# Altium schematic sheet [SCH]_MainProcessor.SchDoc: MOTHERBOARD
size 297 x 209 mm; CheckedBy: THIEN-KEMC; CompanyName: TEAM GA MO; DrawnBy: Vo Hao Hao; Organization: TEAM GA MO; Address1: TEAM GA MO Limited; Address2: 30, Nhat Hamet, Thanh Hoa, Phung Hiep, HG; TGM_Number: TGA-00005-02-1; Projet: EGG INCUBATION (PC-BASED MEASUREMENT AND CONTROL SYSTEMS); ModifiedBy: -; CreateDate: XX/XX/XXXX; CheckedDate: -; Title2: MAIN PROCESSOR ESP32; DivGrp: TGM; Designer: Vo Hao Hao
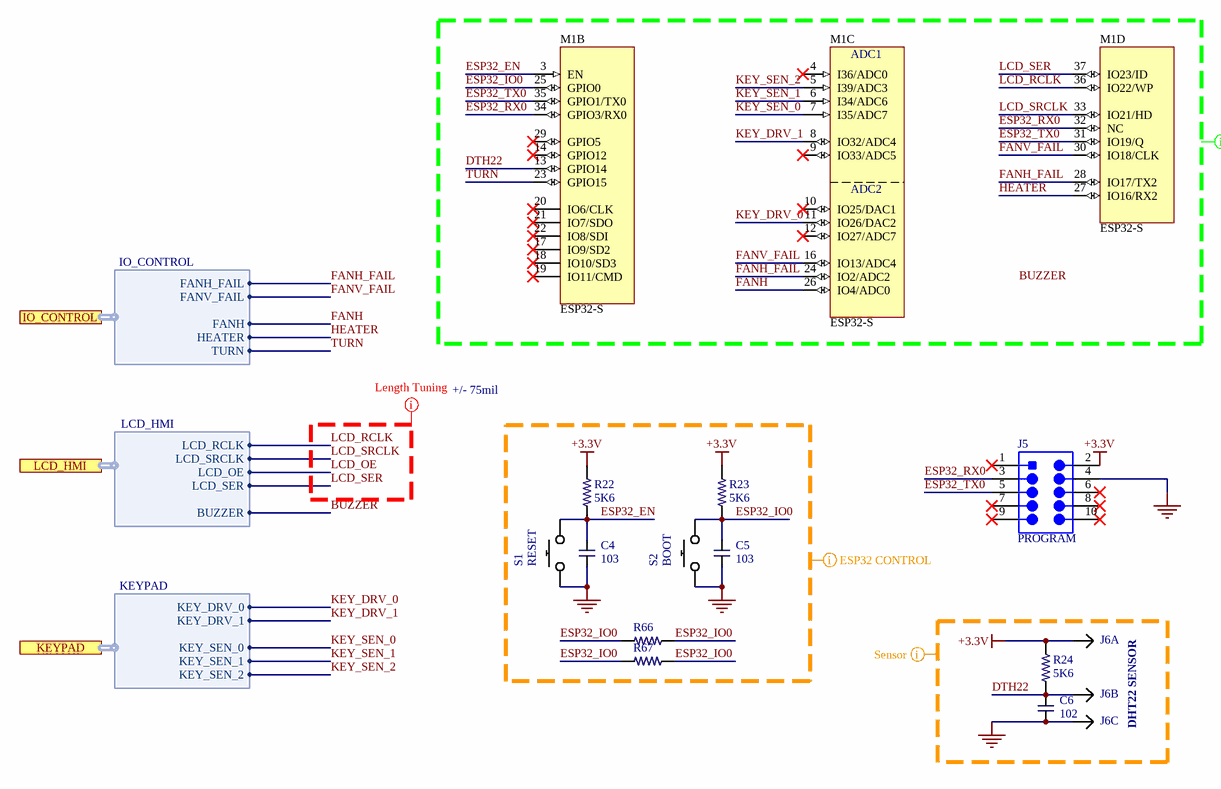
[diagram p0: [SCH]_MainProcessor.SchDoc]

## Parts
C4  103  [CAP-SMD-0805]
C5  103  [CAP-SMD-0805]
C6  102  [CAP-SMD-0805]
J5  PROGRAM  [IDC10]
J6  DHT22  [KF3/5.08]  (value not drawn)  (parts A,B,C of 3)
M1  ESP32-S  [ESP32-S-Footprint]  (parts B,C,D of 4)
R22  value 5K6  [RES-SMD-0805]  (hidden comment: R0805)
R23  value 5K6  [RES-SMD-0805]  (hidden comment: R0805)
R24  value 5K6  [RES-SMD-0805]  (hidden comment: R0805)
R66  R0805  [RES-SMD-0805]  (value not drawn)
R67  R0805  [RES-SMD-0805]  (value not drawn)
S1  RESET  [TL3342F260QG]
S2  BOOT  [TL3342F260QG]

## Ports
IO_CONTROL (harness IO_CONTROL), KEYPAD (harness KEYPAD), LCD_HMI (harness LCD_HMI)

## Harnesses
KEYPAD: KEY_SEN_0, KEY_SEN_1, KEY_SEN_2, KEY_DRV_0, KEY_DRV_1
IO_CONTROL: FANH_FAIL, FANV_FAIL, FANH, HEATER, TURN
LCD_HMI: LCD_RCLK, LCD_SRCLK, LCD_OE, LCD_SER, BUZZER

## Nets
+3.3V: J5.2 J6.1 R22.2 R23.2 R24.2
GND: C4.1 C5.1 C6.1 J5.4 J6.3 S1.1 S2.1
BUZZER: port LCD_HMI.BUZZER
DTH22: C6.2 J6.2 M1.13(GPIO14) R24.1
ESP32_EN: C4.2 M1.3(EN) R22.1 S1.2
ESP32_IO0: C5.2 M1.25(GPIO0) R23.1 R66.1 R66.2 R67.1 R67.2 S2.2
ESP32_RX0: J5.3 M1.32(NC) M1.34(GPIO3/RX0)
ESP32_TX0: J5.5 M1.31(IO19/Q) M1.35(GPIO1/TX0)
FANH: M1.26(IO4/ADC0) ; port IO_CONTROL.FANH
FANH_FAIL: M1.24(IO2/ADC2) M1.28(IO17/TX2) ; port IO_CONTROL.FANH_FAIL
FANV_FAIL: M1.16(IO13/ADC4) M1.30(IO18/CLK) ; port IO_CONTROL.FANV_FAIL
HEATER: M1.27(IO16/RX2) ; port IO_CONTROL.HEATER
KEY_DRV_0: M1.11(IO26/DAC2) ; port KEYPAD.KEY_DRV_0
KEY_DRV_1: M1.8(IO32/ADC4) ; port KEYPAD.KEY_DRV_1
KEY_SEN_0: M1.7(I35/ADC7) ; port KEYPAD.KEY_SEN_0
KEY_SEN_1: M1.6(I34/ADC6) ; port KEYPAD.KEY_SEN_1
KEY_SEN_2: M1.5(I39/ADC3) ; port KEYPAD.KEY_SEN_2
LCD_OE: port LCD_HMI.LCD_OE
LCD_RCLK: M1.36(IO22/WP) ; port LCD_HMI.LCD_RCLK
LCD_SER: M1.37(IO23/ID) ; port LCD_HMI.LCD_SER
LCD_SRCLK: M1.33(IO21/HD) ; port LCD_HMI.LCD_SRCLK
TURN: M1.23(GPIO15) ; port IO_CONTROL.TURN

Not connected (* = marked no-connect by the designer): J5 1* 6* 7* 8* 9* 10*; M1 4(I36/ADC0)* 9(IO33/ADC5)* 10(IO25/DAC1)* 12(IO27/ADC7)* 14(GPIO12)* 17(IO9/SD2)* 18(IO10/SD3)* 19(IO11/CMD)* 20(IO6/CLK)* 21(IO7/SDO)* 22(IO8/SDI)* 29(GPIO5)*

## Layout directives
net class ADC_DATA - 150mil: LCD_OE, LCD_RCLK, LCD_SER, LCD_SRCLK
mark named Sensor: +3.3V, DTH22, GND
mark named ESP32 CONTROL: +3.3V, ESP32_EN, ESP32_IO0, GND
mark named MAIN PROCESSOR: BUZZER, DTH22, ESP32_EN, ESP32_IO0, ESP32_RX0, ESP32_TX0, FANH, FANH_FAIL, FANV_FAIL, HEATER, KEY_DRV_0, KEY_DRV_1, KEY_SEN_0, KEY_SEN_1, KEY_SEN_2, LCD_RCLK, LCD_SER, LCD_SRCLK, TURN

## Notes on the sheet
- +/- 75mil
- (near J6) DHT22 SENSOR
- Labels drawn without touching a wire or pin: BUZZER
- Project/Equipment
- Document
- Designer
- Drawn by
- Check.by
- File
- Last Mod.
- Print Date
- Sheet
- Size
- A4
- of
- Rev
- (in symbol ESP32-S, part C) ADC1; ADC2

## Library data of the parts
C4-C6 = Cap-Non-SMD: Non-polar capacitor
J5 = IDE_5X2: Male Box Header WR-BHD, THT, Vertical, pitch 2.54 mm, 10 pins
J6 = JP3
M1 = ESP32-S: Tensilica Xtensa LX6 microprocessor @ 160 or 240 MHz · 320 KiB SRAM; Bandwidth: 72 MHz; Data Rate: 150 Mbps; Interface: Ethernet, I2C, I2S, SPI, UART; Supply Voltage: 2.7 ~ 3.6 V; Number of ADC Channels: 16; Number of GPIO: 32; Nominal Supply Current: 500 mA; Number of cores: 2; Max CPU Freq: 240 MHz; CPU Name: ESP32-D0WDQ6; ComponentLink1Description: PCB; ComponentLink1URL: https://evertdekker.com/wp/?p=854; Temperature Range: -40 to +85 degC; Height: 3.2 mm
R22-R24 = RES: Chip Resistor, 0805, 1%, 1/8 W; Supplier Part Number 1: 311-1.00KLRCT-ND; PackageReference: J1-0805; PackageDescription: Chip Resistor; Price: 0.005
R66 R67 = RES: Chip Resistor, 0805, 1%, 1/8 W; Value: 0; Supplier Part Number 1: 311-1.00KLRCT-ND; PackageReference: J1-0805; PackageDescription: Chip Resistor; Price: 0.005
S1 S2 = SWITCH TACTILE SPST: SWITCH TACTILE SPST-NO 0.05A 12V; Manufacturer Part Number: TL3342F260QG; Supplier 1: Digi-Key; Supplier Part Number 1: EG5470CT-ND; Price: 0.25